# EAGLE design lipo_b (EAGLE 5.12)
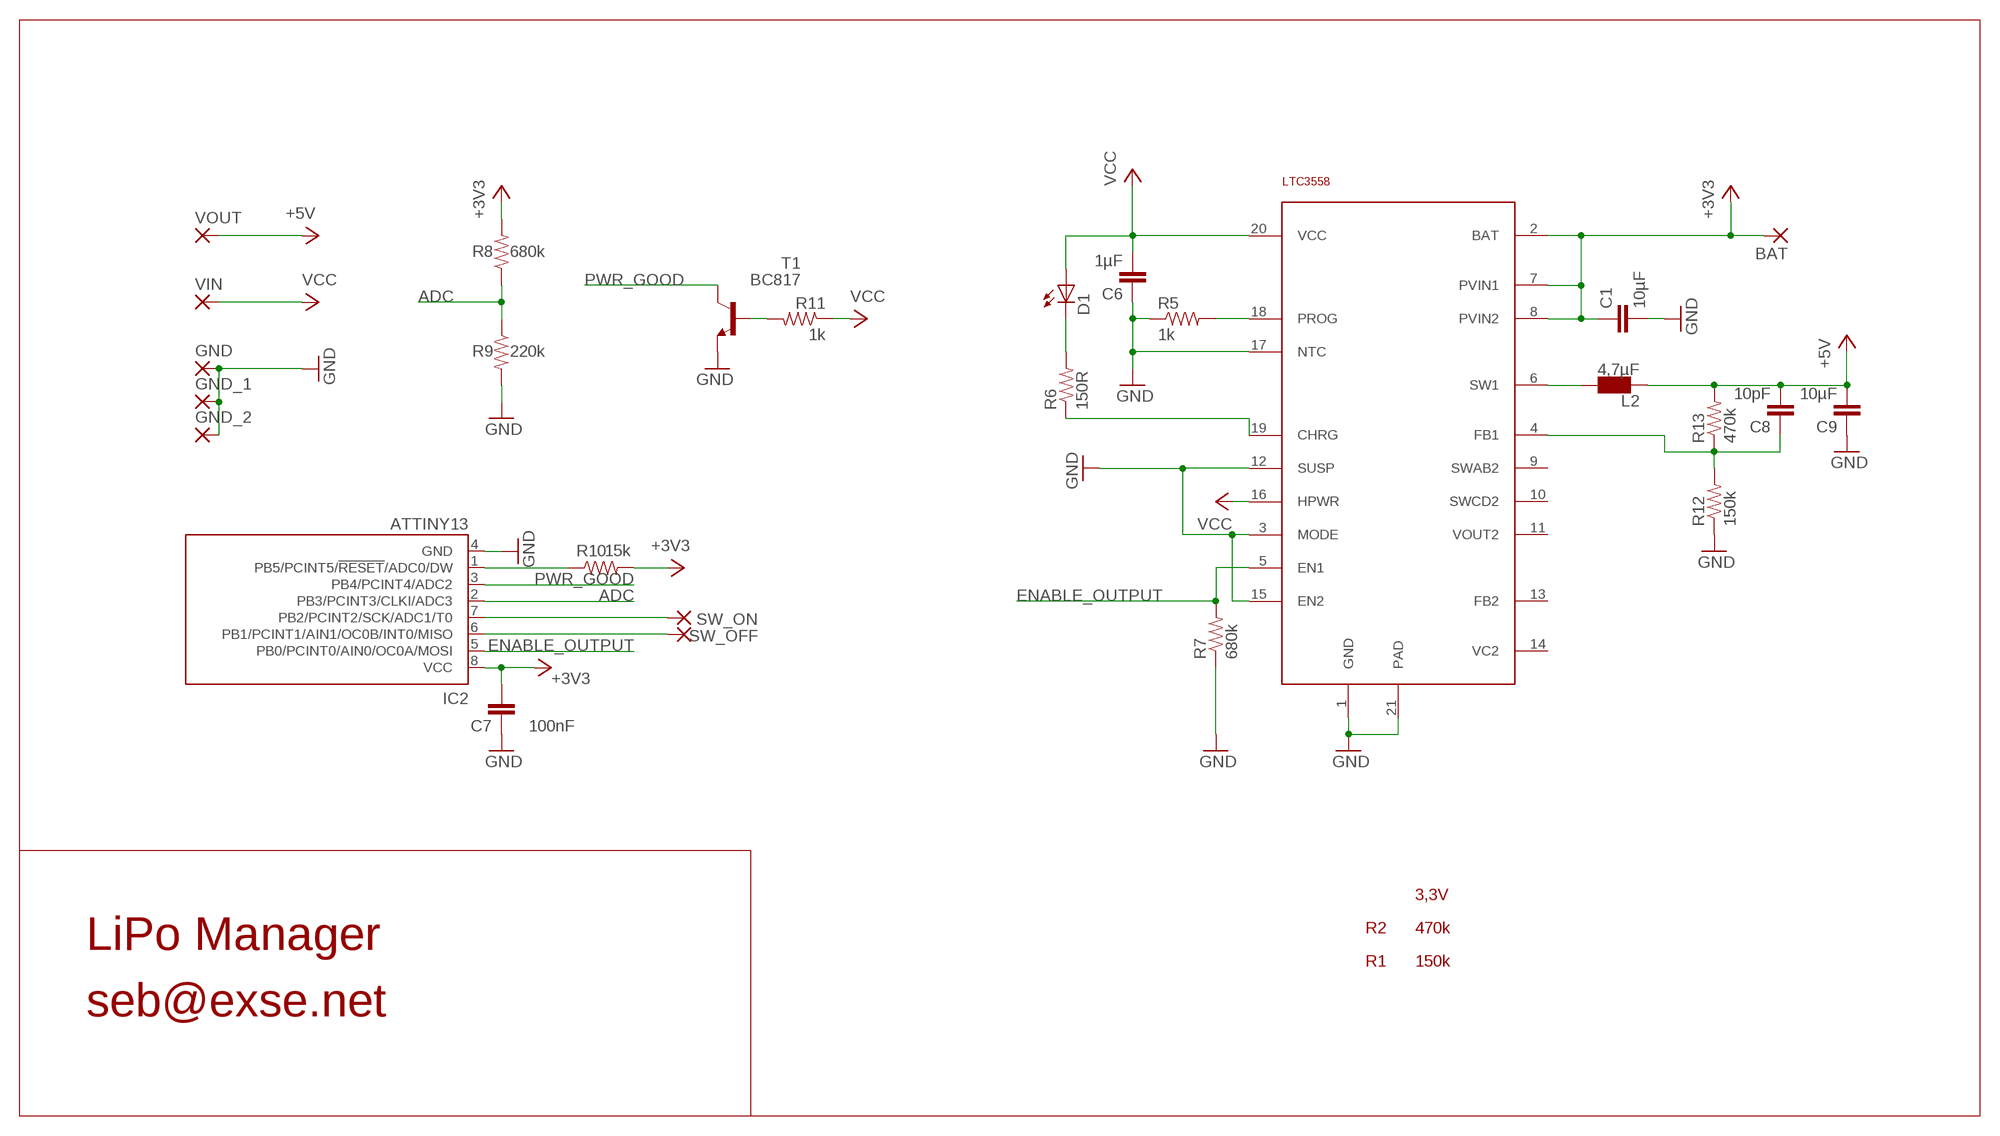
[diagram p0: schematic, sheet 1]

## Parts
BAT  SMD5  [SMD2,54-5,08]
C1  10µF  CAP0805  [0805]
C6  1µF  CAP0805  [0805]
C7  100nF  CAP0805  [0805]
C8  10pF  CAP0805  [0805]
C9  10µF  CAP0805  [0805]
D1  LEDCHIPLED_0805  [CHIPLED_0805]
GND  SMD5  [SMD2,54-5,08]
GND_1  SMD5  [SMD2,54-5,08]
GND_2  SMD5  [SMD2,54-5,08]
IC1  LTC3558  [UD-QFN20]
IC2  ATTINY13  TINY13-20SU  [8S2]
L2  4,7µF  VLF4012A  [VLF4012A]
R5  1k  RESISTOR  [0805]
R6  150R  RESISTOR  [0805]
R7  680k  RESISTOR  [0805]
R8  680k  RESISTOR  [0805]
R9  220k  RESISTOR  [0805]
R10  15k  RESISTOR  [0805]
R11  1k  RESISTOR  [0805]
R12  150k  RESISTOR  [0805]
R13  470k  RESISTOR  [0805]
SW_OFF  SMD5  [SMD2,54-5,08]
SW_ON  SMD5  [SMD2,54-5,08]
T1  BC817  BC847  [SOT23]
VIN  SMD5  [SMD2,54-5,08]
VOUT  SMD5  [SMD2,54-5,08]

## Nets
+3V3: BAT.1(P) C1.1 C7.2 IC1.2(BAT) IC1.7(PVIN1) IC1.8(PVIN2) IC2.8(VCC) R8.2 R10.2
+5V: C8.2 C9.2 L2.P$4 R13.2 VOUT.1(P)
ADC: IC2.2(PB3/PCINT3/CLKI/ADC3) R8.1 R9.1
ENABLE_OUTPUT: IC1.5(EN1) IC2.5(PB0/PCINT0/AIN0/OC0A/MOSI) R7.2
GND: C1.2 C6.1 C7.1 C9.1 GND.1(P) GND_1.1(P) GND_2.1(P) IC1.1(GND) IC1.3(MODE) IC1.12(SUSP) IC1.15(EN2) IC1.17(NTC) IC1.21(PAD) IC2.4(GND) R5.1 R7.1 R9.2 R12.1 T1.2(E)
N$1: C8.1 IC1.4(FB1) R12.2 R13.1
N$2: D1.C R6.2
N$3: IC1.18(PROG) R5.2
N$4: IC1.6(SW1) L2.P$3
N$7: IC2.6(PB1/PCINT1/AIN1/OC0B/INT0/MISO) SW_OFF.1(P)
N$10: IC1.19(CHRG) R6.1
N$11: R11.2 T1.1(B)
N$13: IC2.1(PB5/PCINT5/!RESET!/ADC0/DW) R10.1
N$14: IC2.7(PB2/PCINT2/SCK/ADC1/T0) SW_ON.1(P)
PWR_GOOD: IC2.3(PB4/PCINT4/ADC2) T1.3(C)
VCC: C6.2 D1.A IC1.16(HPWR) IC1.20(VCC) R11.1 VIN.1(P)
Unconnected: IC1.9(SWAB2) IC1.10(SWCD2) IC1.11(VOUT2) IC1.13(FB2) IC1.14(VC2)

## Notes on the sheet
- 3,3V
- R2 | 470k
- LiPo Manager
- R1 | 150k
- seb@exse.net

## Library data of the parts
BAT GND GND_1 GND_2 SW_OFF SW_ON VIN VOUT = wirepad:SMD5: SMD PAD
C1 C6-C9 = SparkFun:CAP: Capacitor Standard 0603 ceramic capacitor, and 0.1" leaded capacitor.
D1 = led:LED: LED OSRAM: - CHIPLED LG R971, LG N971, LY N971, LG Q971, LY Q971, LO R971, LY R971 LH N974, LH R974 LS Q976, LO Q976, LY Q976 LO Q996 - Hyper CHIPLED LW Q18S LB Q993, LB Q99A, LB R99A - SideLED LS A670, LO A670, LY A670, LG A670, LP A670 LB A673, LV A673, LT A673, LW A673 LH A674 LY A675 LS A676, LA A676, LO A676, LY A676, LW A676 LS A679, LY A679, LG A679 - Hyper Micro SIDELED® LS Y876, LA Y876, LO Y876, LY Y876 LT Y87S - SmartLED LW L88C, LW L88S LB L89C, LB L89S, LG L890 LS L89K, LO L89K, LY L89K LS L896, LA L896, LO L896, LY L896 - TOPLED LS T670, LO T670, LY T670, LG T670, LP T670 LSG T670, LSP T670, LSY T670, LOP T670, LYG T670 LG T671, LOG T671, LSG T671 LB T673, LV T673, LT T673, LW T673 LH T674 LS T676, LA T676, LO T676, LY T676, LB T676, LH T676, LSB T676, LW T676 LB T67C, LV T67C, LT T67C, LS T67K, LO T67K, LY T67K, LW E67C LS E67B, LA E67B, LO E67B, LY E67B, LB E67C, LV E67C, LT E67C LW T67C LS T679, LY T679, LG T679 LS T770, LO T770, LY T770, LG T770, LP T770 LB T773, LV T773, LT T773, LW T773 LH T774 LS E675, LA E675, LY E675, LS T675 LS T776, LA T776, LO T776, LY T776, LB T776 LHGB T686 LT T68C, LB T68C - Hyper Mini TOPLED® LB M676 - Mini TOPLED Santana® LG M470 LS M47K, LO M47K, LY M47K Source: http://www.osram.convergy.de LUXEON: - LUMILED® LXK2-PW12-R00, LXK2-PW12-S00, LXK2-PW14-U00, LXK2-PW14-V00 LXK2-PM12-R00, LXK2-PM12-S00, LXK2-PM14-U00 LXK2-PE12-Q00, LXK2-PE12-R00, LXK2-PE12-S00, LXK2-PE14-T00, LXK2-PE14-U00 LXK2-PB12-K00, LXK2-PB12-L00, LXK2-PB12-M00, LXK2-PB14-N00, LXK2-PB14-P00, LXK2-PB14-Q00 LXK2-PR12-L00, LXK2-PR12-M00, LXK2-PR14-Q00, LXK2-PR14-R00 LXK2-PD12-Q00, LXK2-PD12-R00, LXK2-PD12-S00 LXK2-PH12-R00, LXK2-PH12-S00 LXK2-PL12-P00, LXK2-PL12-Q00, LXK2-PL12-R00 Source: www.luxeon.com KINGBRIGHT: KA-3528ASYC Source: www.kingbright.com
IC1 = seb:LTC3558
IC2 = atmel:TINY13: 8-bit AVR Microcontroller with 1K Bytes In-System Programmable Flash Source: http://www.atmel.com/dyn/resources/prod_documents/2535S.pdf; MPN: ATTINY13-20SU; OC_FARNELL: 9171568; OC_NEWARK: 96K6522
L2 = seb:VLF4012A
R5-R13 = SparkFun:RESISTOR: Resistor Basic schematic elements and footprints for 0603, 1206, and PTH 1/10th watt (small) resistors.
T1 = transistor:BC847: NPN TRANSISTOR

## Board
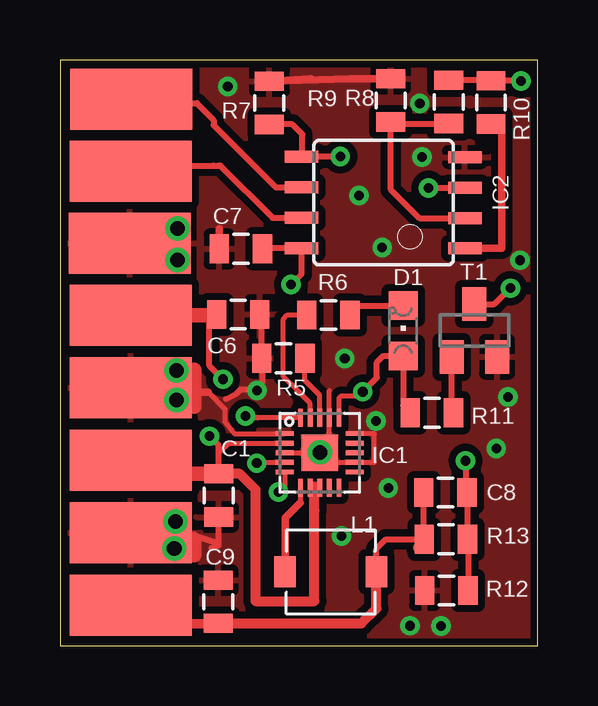
[diagram p1: board, top side]
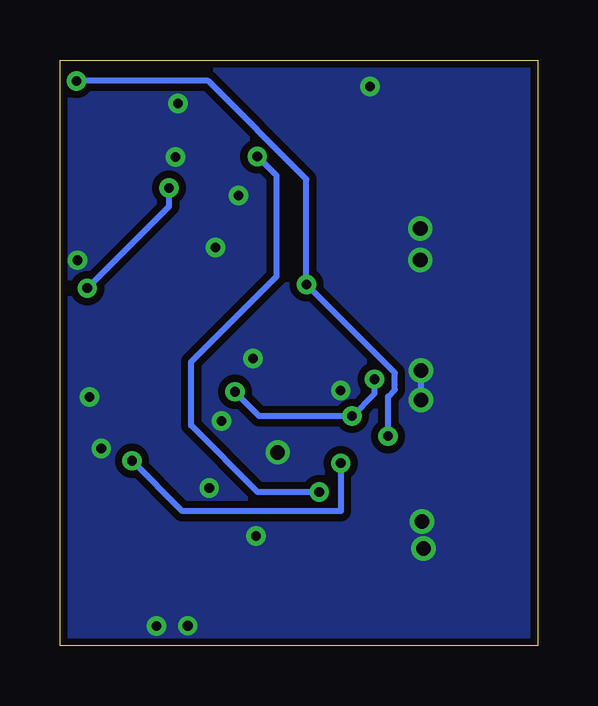
[diagram p2: board, bottom side, seen from below]

Size 19.9 x 24.4 mm. Coordinates in mm from the lower left corner, seen from the top.
Outline: 0,0 19.9,0 19.9,24.4 0,24.4 0,0
Copper layers (1*16): Top 0.035mm / dielectric 1.5mm / Bottom 0.035mm
Design rules "default *": minimum track width 0.2mm, minimum drill 0.3mm, track to track 0.2mm, track to pad 0.2mm, pad to pad 0.2mm, via to via 0.2mm, smd to smd 0.2mm, copper to edge 0.2mm, drill to drill 0.2mm, minimum pad ring 10mil, minimum via ring 8mil, stop-mask expansion 4mil, vias tented up to drill 100mil, thermal gap 10mil

### Footprints (pad centres in the part's own frame; a part is rotated, then mirrored left to right if it is on the bottom)
SMD2,54-5,08 = smd 2.54 x 5.08: 1 0,0
0805 = smd 0.8 x 1.2: 1 -0.9,0; 2 0.9,0
CHIPLED_0805 = smd 1.2 x 1.2: A 0,-1.05; C 0,1.05
UD-QFN20 = smd 0.751 x 0.2: 1 -1.451,0.8; 2 -1.451,0.4; 3 -1.451,0; 4 -1.451,-0.4; 5 -1.451,-0.8; 11 1.451,-0.8; 12 1.451,-0.4; 13 1.451,0; 14 1.451,0.4; 15 1.451,0.8 | smd 0.2 x 0.751: 6 -0.8,-1.451; 7 -0.4,-1.451; 8 0,-1.451; 9 0.4,-1.451; 10 0.8,-1.451; 16 0.8,1.451; 17 0.4,1.451; 18 0,1.451; 19 -0.4,1.451; 20 -0.8,1.451 | smd 1.5 x 1.5: 21 0,0
8S2 = smd 0.5 x 1.4: 1 -1.905,-3.404; 2 -0.645,-3.404; 3 0.625,-3.404; 4 1.895,-3.404; 5 1.905,3.404; 6 0.635,3.404; 7 -0.635,3.404; 8 -1.905,3.404
VLF4012A = smd 0.9 x 1.3: P$3 -1.9,0; P$4 1.9,0
SOT23 = smd 1 x 1.4: 1 -0.95,-1.1; 2 0.95,-1.1; 3 0,1.1

### Placement (x,y rotation side)
BAT  2.96,7.73 90 top
C1  6.61,6.26 270 top
C6  7.43,13.8 180 top
C7  7.53,16.53 0 top
C8  16.06,6.38 180 top
C9  6.6,1.83 270 top
D1  14.3,13.12 0 top
GND  2.96,10.75 90 top
GND_1  2.96,4.71 90 top
GND_2  2.91,16.76 90 top
IC1  10.82,8.04 0 top
IC2  13.47,18.46 90 top
L2  11.28,3.07 0 top
R5  9.31,11.97 0 top
R6  11.19,13.78 0 top
R7  8.72,22.62 270 top
R8  16.2,22.65 90 top
R9  13.78,22.72 90 top
R10  17.95,22.63 90 top
R11  15.5,9.71 0 top
R12  16.1,2.3 0 top
R13  16.08,4.43 180 top
SW_OFF  2.97,22.76 270 top
SW_ON  2.95,19.77 270 top
T1  17.27,13.13 0 top
VIN  2.96,13.77 90 top
VOUT  2.96,1.69 270 top

### Tracks (layer width: path | path; a pad name or v marks a point on that pad's centre or on a via)
+3V3  (via drill 0.4)
  Top 0.2: IC1.7 10.6,6.64 IC1.8 | 6.89,8.29 6.73,8.13 6.61,8.13
  Top 0.203: IC1.2 7.04,8.44 6.89,8.29
  Top 0.254: 7.03,7.16 C1.1 6.61,8.13 | v9.63,15.05 10.06,15.48 IC2.8 8.71,16.55 C7.2 | v19.21,23.53 R10.2 18.04,23.55 R8.2 | 6.61,8.34 v6.23,8.73 | 6.61,8.13 6.61,8.34 | 6.61,8.13 6.61,8.34
  Top 0.305: R8.2 16.24,23.57
  Top 0.406: 10.6,6.64 10.6,5.64 10.6,1.85 8.15,1.85 8.15,6.5 7.7,6.95 7.49,7.16 C1.1
  Top 0.61: C1.1 4.67,7.16 3.33,7.16 BAT.1
  Top 0.813: 4.75,8.28 4.75,7.16 4.67,7.16
  Bottom 0.254: v6.23,8.73 6.23,10.38 5.94,10.66 5.94,11.36 v9.63,15.05 9.63,19.43 13.73,23.53 v19.21,23.53
+5V
  Top 0.254: 14.9,4.12 14.88,4.1 14.87,4.1 | C8.2 15.16,4.44 R13.2 13.58,4.43 13.18,4.03 L2.P$4
  Top 0.305: 14.87,4.05 14.87,4.1 R13.2
  Top 0.406: 3.16,0.86 3.16,0.88 3.17,0.9 C9.2 12.56,0.93 13.18,1.54 L2.P$4
  Top 0.61: VOUT.1 3.16,0.88
ADC
  Top 0.254: R8.1 13.81,21.75 R9.1 13.78,19 14.97,17.81 IC2.2
  Top 0.305: R8.1 16.24,21.62
ENABLE_OUTPUT  (via drill 0.4)
  Top 0.2: v9.1,6.4 9.37,6.67 IC1.5
  Top 0.254: v11.68,20.38 11.66,20.36 IC2.5 10.1,20.4 10.1,21.3 9.68,21.72 R7.2
  Bottom 0.254: v11.68,20.38 10.87,19.59 10.87,15.39 14.44,11.82 14.44,9.17 11.66,6.4 v9.1,6.4
GND  (via drill 0.4 pad 0.3, 0.6 pad 0.3, 0.61 pad 0.3)
  Top 0.2: IC1.1 7.26,8.84 6.87,9.33 6.87,9.86 6.18,10.55 | IC1.3 IC1.21 | 10.32,7.64 IC1.12 13.1,7.64 13.1,8.84 IC1.15
  Top 0.203: GND.1 5.29,10.55 | 11.22,9.48 11.22,8.34 IC1.21 | 11.22,9.48 IC1.17 | 11.22,9.48 11.22,10.63
  Top 0.254: R5.1 8.29,11.86 | R5.1 8.41,13.8 C6.1 | IC1.21 10.32,7.64 | 5.29,10.55 5.27,10.45 v4.86,11.46 | R5.1 8.44,11.94 8.44,10.98 8.14,10.68 7.53,10.68 7.33,10.47 6.92,10.27 | 6.61,4.17 6.32,4.06 | 6.61,4.17 C1.2 | 6.61,4.17 6.47,4.31 5.6,4.61 GND_1.1
  Top 0.305: 5.29,10.55 6.18,10.55 | 5.6,9.96 5.32,10.24 v4.86,10.24 | 5.6,4.61 5.6,4.38 | R9.2 12.12,23.62 R7.1 10.46,23.62 | C7.1 6.63,17.38
  Top 0.61: 5.6,4.38 5.6,3.77 | 5.6,9.96 5.6,11.49
  Bottom 0.254: v4.86,11.46 v4.86,10.24
  other vias: 4.81,5.17 19.17,16.06 4.76,4.05 10.83,8.05 15.88,0.81 8.2,10.63 13.42,16.59 13.68,6.56 4.89,17.38 4.89,16.07 15.09,20.36 14.58,0.83 6.99,23.29 14.99,22.59 12.47,18.76 13.17,9.36 11.87,11.96 18.67,10.36 11.73,4.56 18.18,8.21
  pour Top (isolate 0.3): 0.14,24.51 20.67,24.53 20.44,-0.16 0.42,0.42
  pour Bottom (isolate 0.3): -0.07,24.86 -0.14,-0.03 20.62,-0.07 20.68,24.52
N$1  (via drill 0.4)
  Top 0.2: IC1.4 8.16,7.64 v8.2,7.6
  Top 0.254: R12.2 17,4.4 R13.1 16.98,6.37 C8.1 16.9,6.44 v16.9,7.7
  Bottom 0.254: v8.2,7.6 8.2,5.6 14.8,5.6 v16.9,7.7
N$2
  Top 0.254: R6.2 12.09,14.17 D1.C
N$3
  Top 0.2: IC1.18 10.82,10.43 10.21,11.05 R5.2
  Top 0.203: R5.2 10.32,11.86
N$4
  Top 0.2: IC1.6 10.02,5.97 10,5.95
  Top 0.305: 10,5.95 9.38,5.33 L2.P$3
N$7
  Top 0.254: 2.97,23.06 SW_OFF.1 3.87,23.56 3.94,23.56 4.9,22.6 5.7,22.6 6.4,21.9 6.4,21.69 7.96,20.12 8.99,19.09 IC2.6
N$10
  Top 0.2: 9.31,12.66 9.31,13.61 9.48,13.78 R6.1 | IC1.19 10.42,10.09 9.92,10.59
  Top 0.203: 9.92,10.59 9.31,11.21 9.31,12.66
N$11
  Top 0.254: R11.2 16.32,9.79 T1.1
N$13
  Top 0.305: IC2.1 18.41,16.55 18.41,21.79 17.91,21.79 R10.1
N$14
  Top 0.254: SW_ON.1 3.78,20 6.4,20 | 6.4,20 6.6,20 | IC2.7 8.86,17.82 6.68,20 6.4,20
PWR_GOOD  (via drill 0.4)
  Top 0.254: 15.47,19.08 v15.35,19.07 15.45,19.08 15.47,19.08 | 15.47,19.08 IC2.3 | v18.77,14.89 18.1,14.23 T1.3
  Bottom 0.254: v15.35,19.07 15.35,18.3 v18.77,14.89
VCC  (via drill 0.4 pad 0.3)
  Top 0.2: 8.24,9.49 7.81,9.49 v7.73,9.56 | IC1.16 11.62,10.32 11.7,10.4 12.44,10.4 v12.61,10.58
  Top 0.203: IC1.20 8.24,9.49
  Top 0.254: v6.79,11.1 6.23,11.66 6.23,13.77 | R11.1 14.3,10.01 D1.A 13.47,12.07 13.2,11.8 13.2,11.16 v12.61,10.58
  Top 0.61: C6.2 6.23,13.77 VIN.1
  Bottom 0.254: v12.61,10.58 11.6,9.56 v7.73,9.56 6.79,10.51 v6.79,11.1

### Text on the board
tNames: L1
tValues: 4,7µF
bStop: OFF | ON | GND | Vin | GND | BAT | GND | seb@exse.net | Vout | LiPo-Controller
tDocu: OFF_SW | ON_SW | GND | Vin | GND | Vbat | GND | Vout